# Altium project M0.PrjPcb
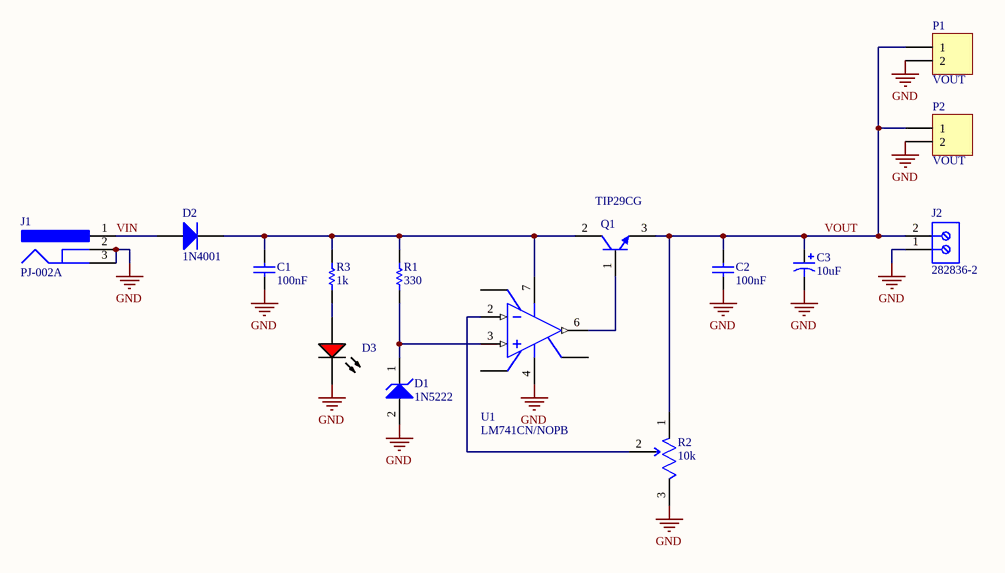
[diagram p0: vreg.SchDoc]
1 sheet, 15 parts. Net scope: global (net labels, ports and power ports of the same name join across sheets).
Board file: vreg.PcbDoc

## Sheet vreg.SchDoc: M0 Voltage Regulator
size Letter; Author: Sean Victor Hum; DrawnBy: Sean Victor Hum; Revision: 1; SheetNumber: 1; SheetTotal: 1

### Parts
C1  value 100nF  [RAD-0.1]  (hidden comment: Cap)
C2  value 100nF  [RAD-0.1]  (hidden comment: Cap)
C3  value 10uF  [RAD-0.1]  (hidden comment: Cap Pol1)
D1  1N5222  [ONSC-SURMETIC40-2-017AA-01]
D2  1N4001  [DO-41]
D3  HLMP-3301  [AVAG-HLMP-3301-2]  (value not drawn)
J1  PJ-002A  [CUI-PJ-002A_V]
J2  282836-2  [TECO-282836-2_V]
P1  VOUT  [HDR1X2]
P2  VOUT  [HDR1X2]
Q1  TIP29CG  [ONSC-TO-220-3-221A-09]
R1  value 330  [RAD-0.1]  (hidden comment: Res1)
R2  10k  [FP-PV37W103C01B00-MFG]
R3  value 1k  [AXIAL-0.4]  (hidden comment: Res1)
U1  LM741CN/NOPB  [P0008A]

### Nets
GND: C1.2 C2.2 C3.2 D1.2(A) D3.1(K) J1.2 J1.3 J2.1 P1.2 P2.2 R2.3 U1.4(V-)
VIN: D2.1(A) J1.1
VOUT: C2.1 C3.1 J2.2 P1.1 P2.1 Q1.3(E) R2.1
NetC1_1: C1.1 D2.2(K) Q1.2(C) R1.2 R3.2 U1.7(V+)
NetD1_1: D1.1(K) R1.1 U1.3(IN+)
NetD3_2: D3.2(A) R3.1
NetQ1_1: Q1.1(B) U1.6(OUT)
NetR2_2: R2.2 U1.2(IN-)

Not connected (* = marked no-connect by the designer): U1 1(OFS_NULL) 5(OFS_NULL) 8(NC)

### Library data of the parts
C1 C2 = Cap: Capacitor; PartNumber: 399-4151-ND; Published: 8-Jun-2000; LatestRevisionDate: 17-Jul-2002; LatestRevisionNote: Re-released for DXP Platform.; PackageReference: RAD-0.3; Publisher: Altium Limited; PackageDescription: Radial Cap, Thru-Hole; 2 Leads; 0.3 in Pin Spacing
C3 = Cap Pol1: Polarized Capacitor (Radial); Published: 8-Jun-2000; LatestRevisionDate: 17-Jul-2002; LatestRevisionNote: Re-released for DXP Platform.; PackageReference: RB7.6-15; Publisher: Altium Limited; PackageDescription: Polarized Capacitor (Radial); 2 Leads
D1 = CMP-1060-01319-1: 5 W Zener Voltage Regulator, 2-Pin Surmetic(TM) 40, Pb-Free, Tape and Reel; Manufacturer: On Semiconductor; PartNumber: 1N5222B-ND; VZ Typ (V): 160; P Max (W): 5; DatasheetVersion: Rev. 14; ComponentLink1Description: Manufacturer URL; ComponentLink2URL: http://www.onsemi.cn/pub_link/Collateral/1N5333B-D.PDF; Mounting Technology: Through Hole; PackageVersion: Rev. O, 09/2005; ComponentLink3URL: http://www.onsemi.cn/pub_link/Collateral/017AA.PDF; RoHS: Pb-Free; PackageReference: SURMETIC40-2-017AA-01; ComponentLink2Description: Datasheet; ComponentLink3Description: Package Specification; Packing: Tape and Reel; ComponentLink1URL: http://www.onsemi.com/; PackageDescription: 2-Pin, Axial Lead, Diameter 3.49 mm
D2 = Diode 1N4001: 1 Amp General Purpose Rectifier; PartNumber: S1011EC-04-ND; Published: 8-Jun-2000; LatestRevisionDate: 17-Jul-2002; LatestRevisionNote: Re-released for DXP Platform.; DatasheetVersion: 1998; PackageVersion: Aug-1999; PackageReference: DO-41; Publisher: Altium Limited; PackageDescription: Diode, Axial; Body 5.2 x 2.7 mm (LxDia. max), Lead Dia. 0.86 mm (max); Code_JEDEC: DO-204-AL; ComponentLink1Description: Manufacturer Link; ComponentLink1URL: http://www.fairchildsemi.com/; ComponentLink2Description: Datasheet; ComponentLink2URL: http://www.fairchildsemi.com/ds/1N%2F1N4001.pdf
D3 = CMP-2000-06411-1: T-1 3/4 (5 mm) Diffused LED Lamp, 1.9 V, -40 to 100 degC, 2-Pin THD, RoHS, Bulk; Manufacturer: Avago; PartNumber: 1497-XCMDK12D-ND; Forward Current: 25mA; Forward Voltage: 2.4V; Peak Wavelength: 635nm; Shape Type: Circular; High Brightness: No; Main Category: StandardLED; Test Current (It): 10mA; Dominant Wave Length: 626nm; Number of  Elements: 1; Reverse Voltage: 5V; Chip Material: GaP; Product Height (mm): 9.19mm; Lens Type: ColoredDiffused; Viewing Angle: 60deg; Type: Uni-Color; Emitting Color: Red; Luminous Intensity: 5.4mcd; Power Dissipation: 85W; DELETED: Compliant; Product Depth (mm): 6.1mm; Package Description: 2-Pin Through Hole LED, Dia 5.85 mm; Mounting Technology: ThroughHole; Manufacturer URL: http://www.avagotech.com/; Package Type: T-13/4; Operating Temp Range: -40Cto100C; Datasheet URL: http://www.avagotech.com/docs/AV02-1558EN; Mounting: ThroughHole; Lens Dimensions: 5.08x5.08x8.3mm; Package Reference: HLMP-3301; Datasheet Version: 03/2015; Pin Count: 2; Packaging: TapeandReel; Operating Temperature Classification: Industrial; Lum Intensity: 5.4mcd; Rad Hardened: No; Product Length (mm): 6.1mm
J1 = CMP-2000-06895-1: Through Hole Right Angle DC Power Jack, 2.5 A, 2 mm Center Pin, 3 Position, -25 to 85 degC, RoHS, Bulk; Manufacturer: CUIInc.; PartNumber: CP-002A-ND; Current Rating: 2.5A; Inside Contact Diameter: 2mm; Insulation Resistance: 50MOhms; Outside Contact Diameter: 6.5mm; Voltage Rating: 24V; Brand: CUI; Operating Temperature Range: -25Cto+85C; Mounting Technology: ThroughHole; Connector Type: DCPowerJack; Contact Material: Copper; Datasheet URL: http://www.cui.com/product/resource/pj-002a.pdf; Contact Gender: Male; Housing Material: PolybutyleneTerephthalate(PBT); Manufacturer URL: http://www.cui.com/; Package Reference: PJ-002A; Mounting Style: ThroughHole; Mounting Angle: Right; Product Category: DCPowerConnectors; Product: Jacks; Flammability Rating: UL94V-0; Contact Plating: Nickel; RoHS: True; Datasheet Version: Rev. 1.03, 04/2016; Package Description: 3-Pin Through Hole Device, Body 14.4 x 9 mm, Height 11 mm; Factory Pack Quantity: 500; Termination Style: ThroughHole
J2 = CMP-1684-00017-1: Female Header, Pitch 5 mm, 1 x 2 Position, Height 10 mm, Tail Length 3.5 mm, Rohs, Bulk; Manufacturer: TE Connectivity; PartNumber: A98076-ND; Wire Gauge: 16-30AWG; Product Training Modules: Wire-to-BoardEurostyleTerminalBlocks; Clamp Material - Plating: Brass-NickelPlated; Voltage: 300V; Mating Orientation: HorizontalwithBoard; Current: 13.5A; Pitch: 0.197"(5.00mm); Screw Thread: M3; 3D Model: 282836-2.pdf; Other Names: 5ULV-02B / A98076; Dynamic Catalog: BuchananSeries; Number of Levels: 1; Torque - Screw: 0.68Nm(6Lb-In); Featured Product: EurostyleTerminalBlockConnectors; Positions Per Level: 2; Wire Termination: Screw-RisingCageClamp; Datasheet URL: http://www.te.com.cn/commerce/DocumentDelivery/DDEController?Action=showdoc&DocId=Catalog+Section%7F1308389_EUROSTYLE_TERMINAL_BLOCKS%7F0607%7Fpdf%7FEnglish%7FENG_CS_1308389_EUROSTYLE_TERMINAL_BLOCKS_0607.pdf%7F282836-2; Color: Green; Family: TerminalBlocks-WiretoBoard; RoHS Information: 282836-2StatementofCompliance; Standard Package: 300; Contact Material - Plating: Brass-TinPlated; Manufacturer URL: http://www.te.com; Housing Material: Polyamide(PA66),Nylon6/6; Features: Interlocking(Side); Package Description: Female Header, Pitch 5 mm, 1 x 2 Position, Height 10 mm, Tail Length 3.5 mm; Mounting Type: ThroughHole; Package Reference: THD; Packaging: Bulk; Series: Buchanan; Category: Connectors,Interconnects; Screw Material - Plating: Brass-NickelPlated
P1 P2 = Header 2: Header, 2-Pin; PartNumber: S1011EC-04-ND; LatestRevisionDate: 17-Jul-2002; LatestRevisionNote: Re-released for DXP Platform.; Publisher: Altium Limited
Q1 = CMP-1048-01094-1: Complementary Silicon Plastic Power Transistor, 3-Pin TO-220, Pb-Free, Tube; Manufacturer: On Semiconductor; PartNumber: TIP29CGOS-ND; Polarity: NPN; IC Continuous (A): 1; fT Min (MHz): 3; ComponentLink1Description: Manufacturer URL; Mounting Technology: Through Hole; PackageVersion: Rev. AG, 09/2011; ComponentLink1URL: http://www.onsemi.com/; RoHS: TRUE; ComponentLink3Description: Package Specification; ComponentLink2Description: Datasheet; DatasheetVersion: Rev. 12; ComponentLink3URL: http://www.onsemi.com/pub_link/Collateral/221A-09.PDF; ComponentLink2URL: http://www.onsemi.com/pub_link/Collateral/TIP29B-D.PDF; PackageDescription: 3-Pin Flange Mount, Vertical Straight Lead, Body 9.97 x 4.445 mm, Pitch 2.54 mm; PackageReference: TO-220-3-221A-09; Packing: Tube; Parameter 1: *
R1 = Res1: Resistor; PartNumber: 330QBK-ND; Published: 8-Jun-2000; LatestRevisionDate: 17-Jul-2002; LatestRevisionNote: Re-released for DXP Platform.; PackageReference: AXIAL-0.3; Publisher: Altium Limited; PackageDescription: Axial Device, Thru-Hole; 2 Leads; 0.3 in Pin Spacing
R2 = CMP-07234-000029-1: TRIMMER 10K OHM 0.25W PC PIN TOP PV37W103C01B00; PartNumber: 490-2970-ND; Resistance: 10kR; Temperature Coefficient: 150ppm/°C; Tolerance: 10%; Number of Turns: 12; Max Power Dissipation: 250mW; Mount: Through Hole; Packaging: Bulk; Height: 0.264inch; Resistor Type: Cermet; Termination: PC Pins; RoHS Compliant: No
R3 = Res1: Resistor; PartNumber: CF14JT1K00CT-ND; Published: 8-Jun-2000; LatestRevisionDate: 17-Jul-2002; LatestRevisionNote: Re-released for DXP Platform.; PackageReference: AXIAL-0.3; Publisher: Altium Limited; PackageDescription: Axial Device, Thru-Hole; 2 Leads; 0.3 in Pin Spacing
U1 = CMP-0055-00162-3: Operational Amplifier, 8-pin MDIP, Pb-Free; PartNumber: LM741CNNS/NOPB-ND; Manufacturer: Texas Instruments; PackageTopMarking: NSUZXYTTE#*LM*741CN; PowerWise: N; CompType: Amplifiers; ComponentLink1Description: Datasheet URL; ComponentLink1URL: http://www.ti.com/general/docs/lit/getliterature.tsp?genericPartNumber=LM741&fileType=pdf; PackageDescription: MDIP, .365 x .250 x .130in, 8 Lead, .100in Pitch; RoHS: Y; PinCount: 8; Code_JEDEC: MS-001-BA; Package Reference: P0008A